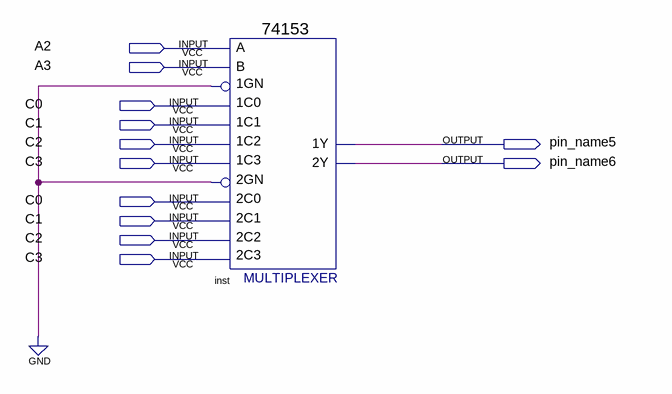
[diagram p0: schematic sheet]
// Quartus schematic Ex5.bdf as structural Verilog: 1 symbols, 12 pins
module Ex5 (
  input  A2,
  input  A3,
  input  C0,
  input  C1,
  input  C2,
  input  C3,
  output pin_name5,
  output pin_name6
);

  \74153  inst (
    .\1C1 (C1), .\1GN (1'b0), .\1C0 (C0), .\2GN (1'b0), .\2C2 (C2), .\1C2 (C2), .\1C3 (C3), .\2C1 (C1),
    .\1Y (pin_name5), .\2Y (pin_name6));  // open: 2C0, B, A, 2C3
endmodule
